# Altium schematic sheet TopLevel.SchDoc
size 215 x 279 mm; SheetNumber: 1; SheetTotal: 6
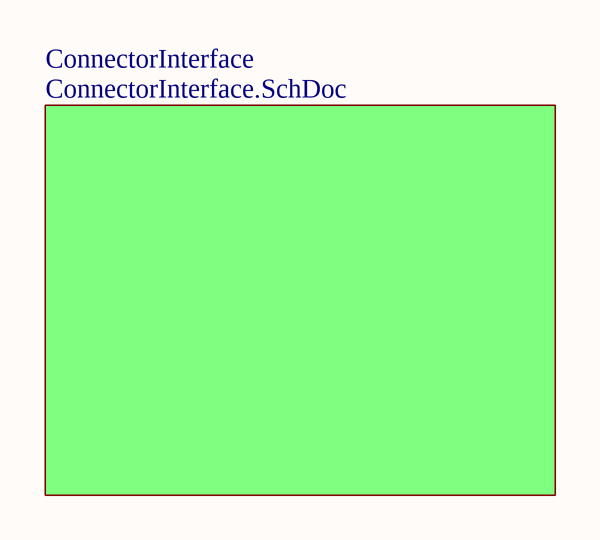
[diagram p0: TopLevel.SchDoc]

## Sub-sheets
ConnectorInterface = ConnectorInterface.SchDoc: no entries

## Notes on the sheet
- Contents
- Revision Notes